# Altium schematic sheet МПСУ-46342.21-004 Э3 Лист6.SchDoc
size 297 x 209 mm; Address1: Address1; Address2: Address2; Address3: Address3; Address4: Address4; SheetNumber: 1; Scale: 1:1; Обозначение документа: АБВГ.123456.001 Э3
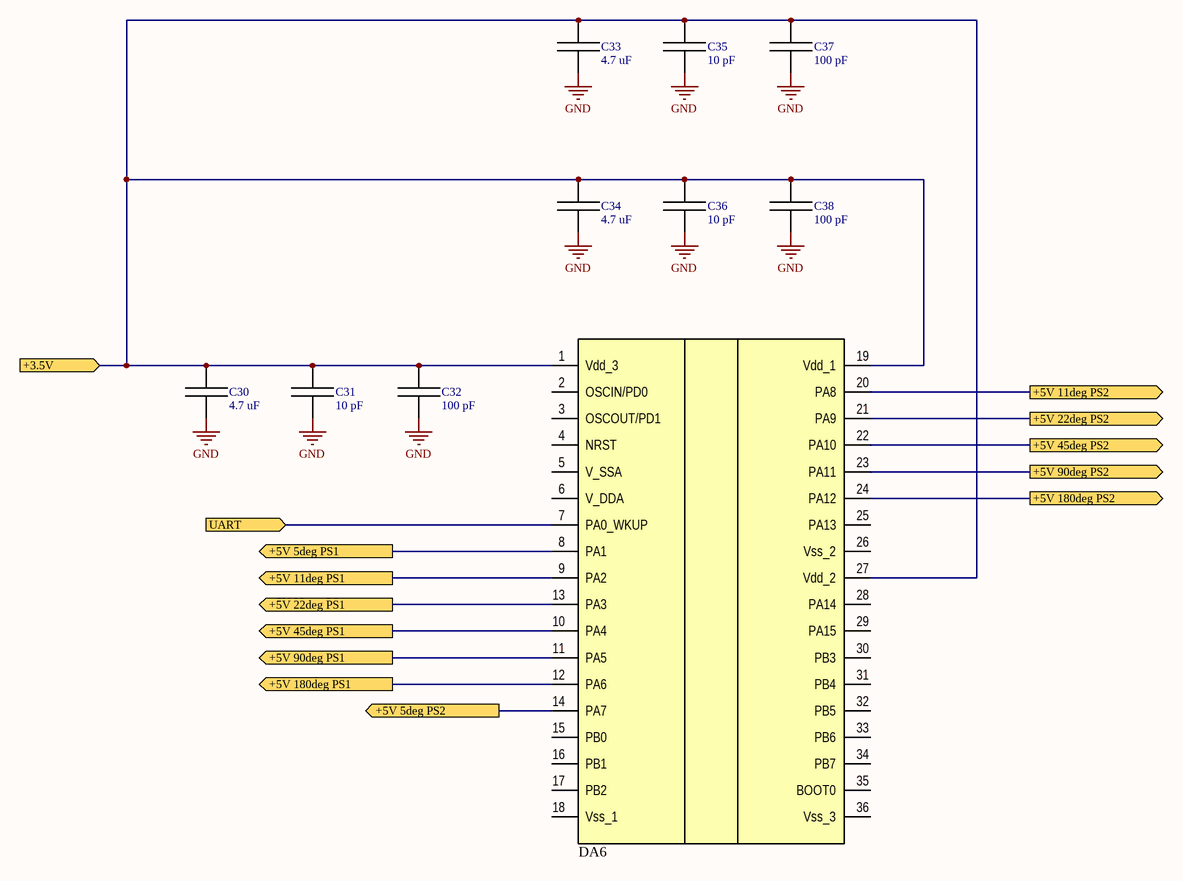
[diagram p0: МПСУ-46342.21-004 Э3 Лист6.SchDoc]

## Parts
C30  4.7 uF  [CAPC100X50X55L20N]
C31  10 pF  [CAPC100X50X55L20N]
C32  100 pF  [CAPC100X50X55L20N]
C33  4.7 uF  [CAPC100X50X55L20N]
C34  4.7 uF  [CAPC100X50X55L20N]
C35  10 pF  [CAPC100X50X55L20N]
C36  10 pF  [CAPC100X50X55L20N]
C37  100 pF  [CAPC100X50X55L20N]
C38  100 pF  [CAPC100X50X55L20N]
DA6  (no value)  [QFN50P600X600X90_HS-37N]

## Ports
+3.5V (in), +5V 5deg PS1 (out), +5V 5deg PS2 (out), +5V 11deg PS1 (out), +5V 11deg PS2 (out), +5V 22deg PS1 (out), +5V 22deg PS2 (out), +5V 45deg PS1 (out), +5V 45deg PS2 (out), +5V 90deg PS1 (out), +5V 90deg PS2 (out), +5V 180deg PS1 (out), +5V 180deg PS2 (out), UART (in)

## Nets
GND: C30.1 C31.1 C32.1 C33.1 C34.1 C35.1 C36.1 C37.1 C38.1
+3.5V: C30.2 C31.2 C32.2 C33.2 C34.2 C35.2 C36.2 C37.2 C38.2 DA6.1(Vdd_3) DA6.19(Vdd_1) DA6.27(Vdd_2) ; port +3.5V
+5V 5deg PS1: DA6.8(PA1) ; port +5V 5deg PS1
+5V 5deg PS2: DA6.14(PA7) ; port +5V 5deg PS2
+5V 11deg PS1: DA6.9(PA2) ; port +5V 11deg PS1
+5V 11deg PS2: DA6.20(PA8) ; port +5V 11deg PS2
+5V 22deg PS1: DA6.13(PA3) ; port +5V 22deg PS1
+5V 22deg PS2: DA6.21(PA9) ; port +5V 22deg PS2
+5V 45deg PS1: DA6.10(PA4) ; port +5V 45deg PS1
+5V 45deg PS2: DA6.22(PA10) ; port +5V 45deg PS2
+5V 90deg PS1: DA6.11(PA5) ; port +5V 90deg PS1
+5V 90deg PS2: DA6.23(PA11) ; port +5V 90deg PS2
+5V 180deg PS1: DA6.12(PA6) ; port +5V 180deg PS1
+5V 180deg PS2: DA6.24(PA12) ; port +5V 180deg PS2
UART: DA6.7(PA0_WKUP) ; port UART

Not connected (* = marked no-connect by the designer): DA6 2(OSCIN/PD0) 3(OSCOUT/PD1) 4(NRST) 5(V_SSA) 6(V_DDA) 15(PB0) 16(PB1) 17(PB2) 18(Vss_1) 25(PA13) 26(Vss_2) 28(PA14) 29(PA15) 30(PB3) 31(PB4) 32(PB5) 33(PB6) 34(PB7) 35(BOOT0) 36(Vss_3)

## Notes on the sheet
- Подп. и дата
- Инв. № дубл.
- Взам. инв. №
- Инв. № подл.
- Изм.
- Лист
- № докум.
- Подп.
- Дата
- Копировал
- Формат А4

## Library data of the parts
C30-C38 = Capacitor: Capacitor, generic; Tolerance: 5 %; VDC: 20 V; PartNumber: *; Dielectric: *; Manufacturer: *; Package: 0402
  C30 C33 C34: Value: 4.7 uF
  C31 C35 C36: Value: 10 pF
  C32 C37 C38: Value: 100 pF
DA6 = GD32VF103Tx